# EAGLE schematic Arm Board V4 (EAGLE 6.5.0)

## Sheet 1 of 4: Power
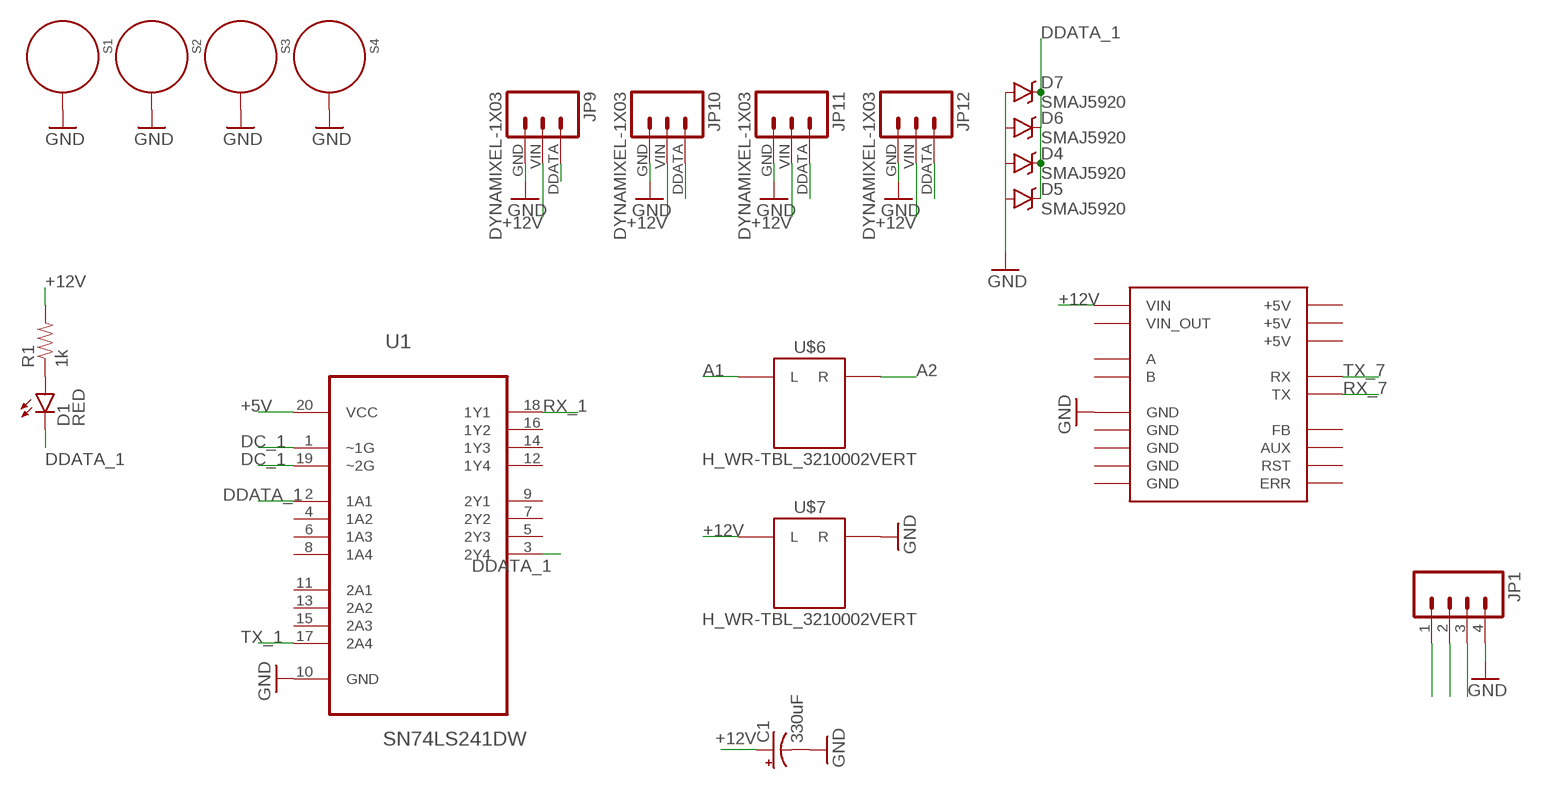
[diagram p0: schematic, sheet 1]

### Parts
C1  330uF  CAP_POLE  [PANASONIC_E]
D1  RED  LED1206  [LED-1206]
D4  SMAJ5920  DIODE-SCHOTTKY-MBRA140  [SMA-DIODE]
D5  SMAJ5920  DIODE-SCHOTTKY-MBRA140  [SMA-DIODE]
D6  SMAJ5920  DIODE-SCHOTTKY-MBRA140  [SMA-DIODE]
D7  SMAJ5920  DIODE-SCHOTTKY-MBRA140  [SMA-DIODE]
JP1  M04PTH  [1X04]
JP9  DYNAMIXEL-1X03  [DYNAMIXEL-1X03]
JP10  DYNAMIXEL-1X03  [DYNAMIXEL-1X03]
JP11  DYNAMIXEL-1X03  [DYNAMIXEL-1X03]
JP12  DYNAMIXEL-1X03  [DYNAMIXEL-1X03]
R1  1k  RESISTOR1206  [1206]
S1  STANDOFF_ELECTRICAL  [STANDOFF-ELECTRICAL]
S2  STANDOFF_ELECTRICAL  [STANDOFF-ELECTRICAL]
S3  STANDOFF_ELECTRICAL  [STANDOFF-ELECTRICAL]
S4  STANDOFF_ELECTRICAL  [STANDOFF-ELECTRICAL]
U1  SN74LS241DW  [SOIC127P1030X265-20N]
U$1  TORXIS_BREAKOUT  [TORXIS_BREAKOUT]
U$6  H_WR-TBL_3210002VERT  [691321100002]
U$7  H_WR-TBL_3210002VERT  [691321100002]

### Nets
+5V: JP1.3 U1.20(VCC) ; also sheet 2
+12V: C1.+ JP9.VIN JP10.VIN JP11.VIN JP12.VIN R1.2 U$1.VIN U$7.L ; also sheet 4
A1: U$6.L ; also sheet 4
A2: U$6.R ; also sheet 4
DC_1: U1.1(~1G) U1.19(~2G) ; also sheet 2
DDATA_1: D1.C D4.C D5.C D6.C D7.C JP9.DDATA JP10.DDATA JP11.DDATA JP12.DDATA U1.2(1A1) U1.3(2Y4)
GND: C1.- D4.A D5.A D6.A D7.A JP1.4 JP9.GND JP10.GND JP11.GND JP12.GND S1.P1 S2.P1 S3.P1 S4.P1 U1.10(GND) U$1.GND@1(GND) U$7.R ; also sheet 2,3,4
N$13: D1.A R1.1
RX_1: U1.18(1Y1) ; also sheet 2
RX_3: JP1.2 ; also sheet 2,3
RX_7: U$1.TX ; also sheet 2
TX_1: U1.17(2A4) ; also sheet 2
TX_3: JP1.1 ; also sheet 2,3
TX_7: U$1.RX ; also sheet 2
Unconnected: U1.4(1A2) U1.5(2Y3) U1.6(1A3) U1.7(2Y2) U1.8(1A4) U1.9(2Y1) U1.11(2A1) U1.12(1Y4) U1.13(2A2) U1.14(1Y3) U1.15(2A3) U1.16(1Y2) U$1.+5V@1(+5V) U$1.+5V@2(+5V) U$1.+5V_OUT(+5V) U$1.A U$1.AUX U$1.B U$1.ERR U$1.FB U$1.GND@2(GND) U$1.GND@3(GND) U$1.GND@4(GND) U$1.GND@5(GND) U$1.RST U$1.VIN_OUT

## Sheet 2 of 4: Processor
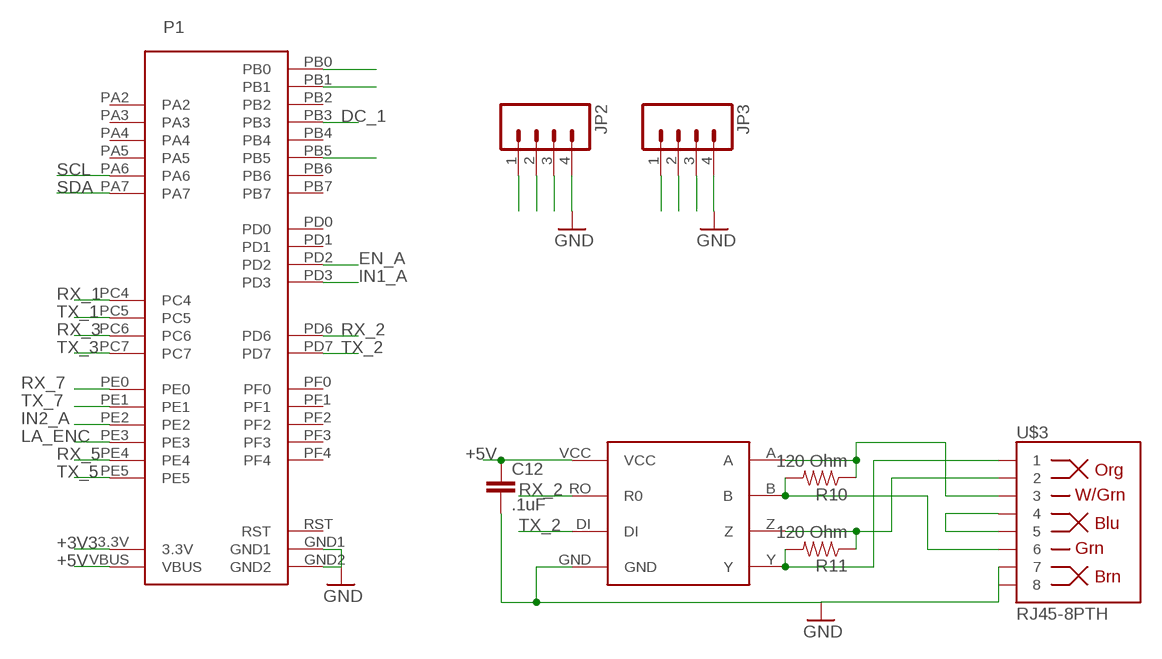
[diagram p1: schematic, sheet 2]

### Parts
C12  .1uF  CAP1206  [1206]
JP2  M04PTH  [1X04]
JP3  M04PTH  [1X04]
P1  STELLARIS-LAUNCHPADSTELLARIS-LAUNCHPAD-XL  [LAUNCHPAD-XL]
R10  120 Ohm  RESISTOR1206  [1206]
R11  120 Ohm  RESISTOR1206  [1206]
U$3  RJ45-8PTH  [RJ45-8]
U$4  MAX3077  [MAX3070E]

### Nets
+3V3: P1.3.3V ; also sheet 3
+5V: C12.1 JP2.3 JP3.3 P1.VBUS U$3.4 U$3.5 U$4.VCC ; also sheet 1
DC_1: P1.PB3 ; also sheet 1
EN_A: P1.PD2 ; also sheet 4
GND: C12.2 JP2.4 JP3.4 P1.GND1 P1.GND2 U$3.7 U$3.8 U$4.GND ; also sheet 1,3,4
IN1_A: P1.PD3 ; also sheet 4
IN2_A: P1.PE2 ; also sheet 4
INT1_XM: P1.PB1
INT2_XM: P1.PB0
INT_G: P1.PB5
LA_ENC: P1.PE3
RX+: R10.1 U$3.3 U$4.A
RX-: R10.2 U$3.6 U$4.B
RX_1: P1.PC4 ; also sheet 1
RX_2: P1.PD6 U$4.RO(R0)
RX_3: P1.PC6 ; also sheet 1,3
RX_5: JP3.2 P1.PE4
RX_7: JP2.2 P1.PE0 ; also sheet 1
SCL: P1.PA6
SDA: P1.PA7
TX+: R11.2 U$3.1 U$4.Y
TX-: R11.1 U$3.2 U$4.Z
TX_1: P1.PC5 ; also sheet 1
TX_2: P1.PD7 U$4.DI
TX_3: P1.PC7 ; also sheet 1,3
TX_5: JP3.1 P1.PE5
TX_7: JP2.1 P1.PE1 ; also sheet 1
Unconnected: P1.PA2 P1.PA3 P1.PA4 P1.PA5 P1.PB2 P1.PB4 P1.PB6 P1.PB7 P1.PD0 P1.PD1 P1.PF0 P1.PF1 P1.PF2 P1.PF3 P1.PF4

## Sheet 3 of 4: Xbee
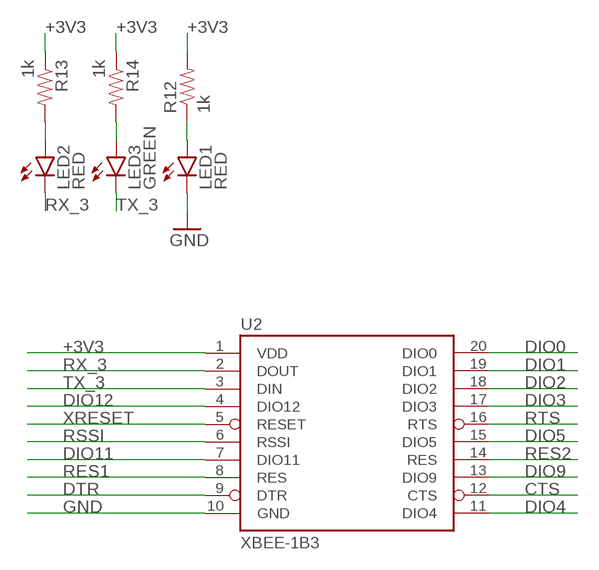
[diagram p2: schematic, sheet 3]

### Parts
LED1  RED  LED1206  [LED-1206]
LED2  RED  LED1206  [LED-1206]
LED3  GREEN  LED-GREENLARGE  [LED-1206]
R12  1k  RESISTOR1206  [1206]
R13  1k  RESISTOR1206  [1206]
R14  1k  RESISTOR1206  [1206]
U2  XBEE-1B3  [XBEE-SMD]

### Nets
+3V3: R12.2 R13.1 R14.1 U2.1(VDD) ; also sheet 2
CTS: U2.12(CTS)
DIO0: U2.20(DIO0)
DIO1: U2.19(DIO1)
DIO2: U2.18(DIO2)
DIO3: U2.17(DIO3)
DIO4: U2.11(DIO4)
DIO5: U2.15(DIO5)
DIO9: U2.13(DIO9)
DIO11: U2.7(DIO11)
DIO12: U2.4(DIO12)
DTR: U2.9(DTR)
GND: LED1.C U2.10(GND) ; also sheet 1,2,4
N$4: LED2.A R13.2
N$6: LED3.A R14.2
N$38: LED1.A R12.1
RES1: U2.8(RES)
RES2: U2.14(RES)
RSSI: U2.6(RSSI)
RTS: U2.16(RTS)
RX_3: LED2.C U2.2(DOUT) ; also sheet 1,2
TX_3: LED3.C U2.3(DIN) ; also sheet 1,2
XRESET: U2.5(RESET)

## Sheet 4 of 4: H-bridge
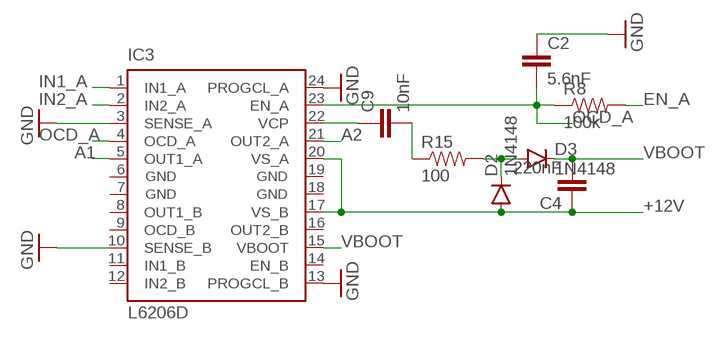
[diagram p3: schematic, sheet 4]

### Parts
C2  5.6nF  CAP1206  [1206]
C4  220nF  CAP1206  [1206]
C9  10nF  CAP1206  [1206]
D2  1N4148  DIODESOD123  [SOD-123]
D3  1N4148  DIODESOD123  [SOD-123]
IC3  L6206D  [SO24]
R8  100k  RESISTOR1206  [1206]
R15  100  RESISTOR1206  [1206]

### Nets
+12V: C4.1 D2.A IC3.17(VS_B) IC3.20(VS_A) ; also sheet 1
A1: IC3.5(OUT1_A) ; also sheet 1
A2: IC3.21(OUT2_A) ; also sheet 1
EN_A: R8.2 ; also sheet 2
GND: C2.1 IC3.3(SENSE_A) IC3.10(SENSE_B) IC3.13(PROGCL_B) IC3.24(PROGCL_A) ; also sheet 1,2,3
IN1_A: IC3.1(IN1_A) ; also sheet 2
IN2_A: IC3.2(IN2_A) ; also sheet 2
N$17: D2.C D3.A R15.2
N$18: C9.2 R15.1
N$19: C9.1 IC3.22(VCP)
OCD_A: C2.2 IC3.4(OCD_A) IC3.23(EN_A) R8.1
VBOOT: C4.2 D3.C IC3.15(VBOOT)
Unconnected: IC3.8(OUT1_B) IC3.9(OCD_B) IC3.11(IN1_B) IC3.12(IN2_B) IC3.14(EN_B) IC3.16(OUT2_B)

## Power pins joined to a net without a drawn wire
GND: IC3.6(GND) IC3.7(GND) IC3.18(GND) IC3.19(GND)
RST: P1.RST

## Library data of the parts
C1 = SparkFun-Capacitors:CAP_POL: Capacitor Polarized These are standard SMD and PTH capacitors. Normally 10uF, 47uF, and 100uF in electrolytic and tantalum varieties. Always verify the external diameter of the through hole cap, it varies with capacity, voltage, and manufacturer. The EIA devices should be standard.
C2 C4 C9 = SparkFun-Passives:CAP: Capacitor Standard 0603 ceramic capacitor, and 0.1" leaded capacitor.
C12 = SparkFun-Capacitors:CAP: Capacitor Standard 0603 ceramic capacitor, and 0.1" leaded capacitor.
D1 LED1 LED2 = SparkFun-LED:LED: LEDs Standard schematic elements and footprints for 5mm, 3mm, 1206, and 0603 sized LEDs. 5mm - Spark Fun Electronics SKU : COM-00529 (and others)
D2 D3 = SparkFun-DiscreteSemi:DIODE: Diode These are standard reverse protection diodes and small signal diodes. SMA package can handle up to about 1A. SOD-323 can handle about 200mA. What the SOD-323 package when ordering, there are some mfgs out there that are 5-pin packages.
D4-D7 = SparkFun-DiscreteSemi:DIODE-SCHOTTKY: Schottky diodes in SFE's production catalog BAT20J 1A 23V 0.62Vf RB751 120mA 40V 0.37Vf PMEG4005EJ 0.5A 40V 0.42Vf MBRA140 1A 40V 0.5Vf B340A 3A 40V SMA; PROD_ID: DIO-08053; VALUE: MBRA140
IC3 = L6206D:L6206: DUAL DMOS FULL BRIDGE MOTOR DRIVER
JP1-JP3 = SparkFun-Connectors:M04: Header 4 Standard 4-pin 0.1" header. Use with straight break away headers (SKU : PRT-00116), right angle break away headers (PRT-00553), swiss pins (PRT-00743), machine pins (PRT-00117), and female headers (PRT-00115). Molex polarized connector foot print use with SKU : PRT-08231 with associated crimp pins and housings. 1MM SMD Version SKU: PRT-10208
JP9-JP12 = MRDT-2015-Arm:DYNAMIXEL-1X03
LED3 = SparkFun-LED:LED-GREEN: Various green LEDs Green LEDs used in SFE Production 0603- DIO-00821 LARGE- DIO-00862 LILYPAD- DIO-09910; PROD_ID: DIO-00862
P1 = StellarisLaunchPad_Fred:STELLARIS-LAUNCHPAD
R1 R8 R15 = SparkFun-Resistors:RESISTOR: Resistor Basic schematic elements and footprints for 0603, 1206, and PTH resistors.
R10-R14 = SparkFun-Passives:RESISTOR: Resistor Basic schematic elements and footprints for 0603, 1206, and PTH resistors.
S1-S4 = SparkFun-Electromechanical:STANDOFF_ELECTRICAL: A standoff intended to be an electrically connected point. Pad size and stop size allow for a #4 Phillips pan screw head to make a solid connection to the board.
U1 = 74LS241:SN74LS241DW: OCTAL BUFFERS AND LINE DRIVERS WITH 3-STATE OUTPUTS; MPN: SN74LS241DW; OC_FARNELL: 1739687; OC_NEWARK: 50R6539; PACKAGE: SOIC-20; SUPPLIER: Texas Instruments
U2 = SparkFun:XBEE-1
U$1 = MRDT-2015-Arm:TORXIS_BREAKOUT
U$3 = SparkFun-Connectors:RJ45-8: RJ45 Jack Simple RJ45, 8-pin connection - connector for common Cat5, Cat5e, and Cat6 Ethernet cables. Footprint not yet proven in production. Connector sku is PRT-00643; Breakout PCB sku is BOB-00716.; PROD_ID: CONN-08506; VALUE: RJ45
U$4 = MAX3077:MAX3077
U$6 U$7 = MRDT-2015-PowerBoard:H_WR-TBL_32*1*0002: Wurth Electronic's 2-pin 10A pluggable screw terminal headers. Vertical and Horizantal Part Numbers: 691322110002 (Horizantal) 691321100002 (Vertical); DIGIKEY_PN: 732-2763-ND

## Net classes
1 USB: drill 0.406 mm, clearance 0.203 mm to class 0, clearance 0.406 mm
3 usbvcc: width 0.61 mm, drill 0.508 mm, clearance 0.203 mm to class 0, clearance 0.254 mm